# Altium schematic sheet Power.SchDoc
size A
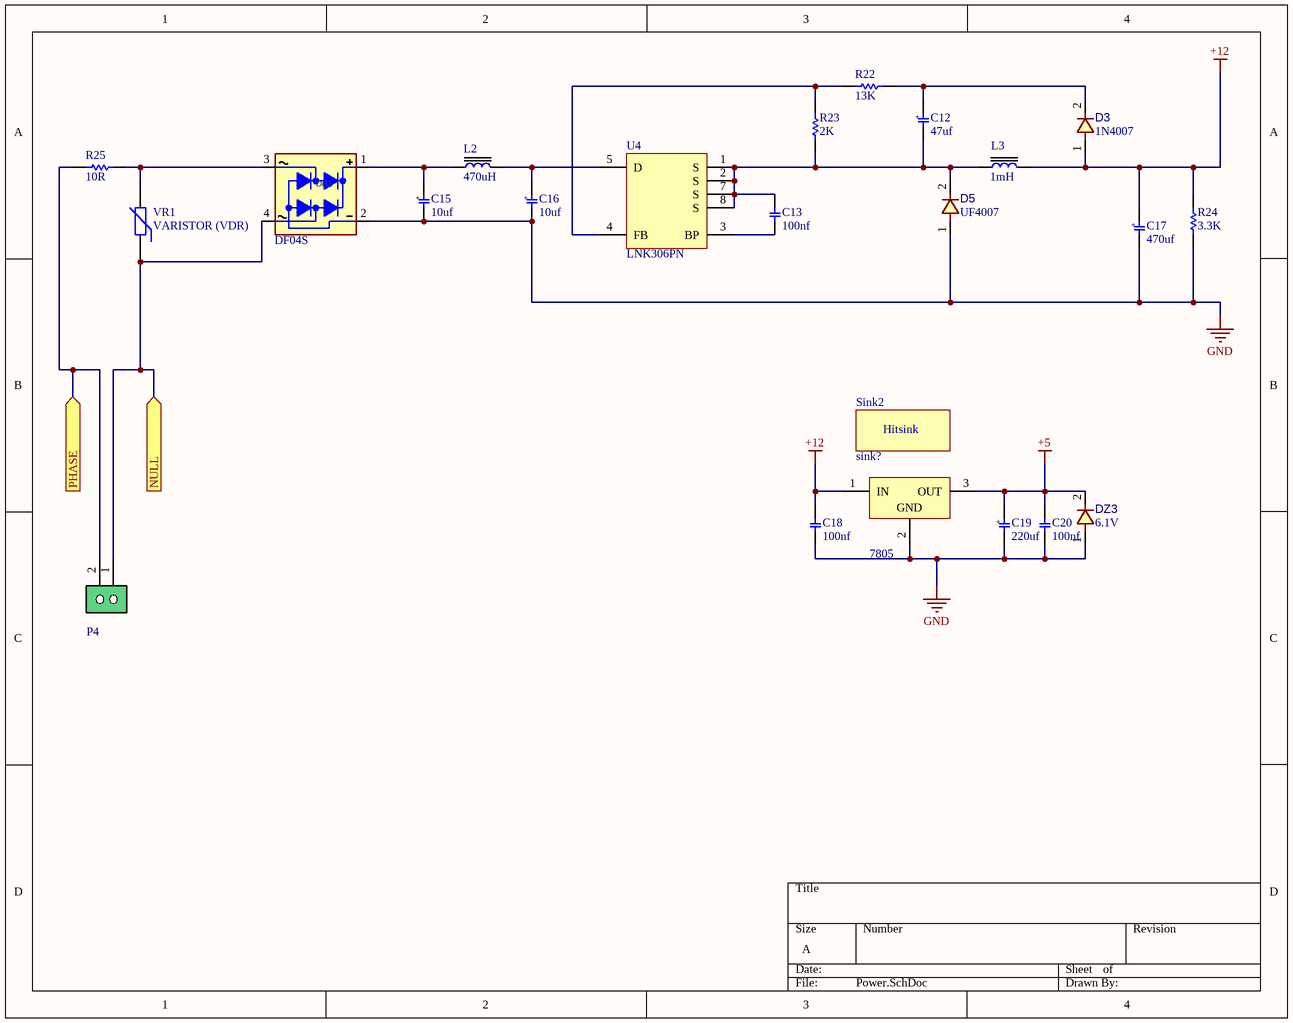
[diagram p0: Power.SchDoc]

## Parts
7805  7805CV  [TO220]  (value not drawn)
C12  value 47uf  [C_EL_6X11]  (hidden comment: Capacitor Electrical THD)
C13  value 100nf  [C1206]  (hidden comment: Capacitor C SMD 1206)
C15  value 10uf  [C_EL_10X20]  (hidden comment: Capacitor Electrical THD)
C16  value 10uf  [C_EL_10X20]  (hidden comment: Capacitor Electrical THD)
C17  value 470uf  [C_EL_10X20]  (hidden comment: Capacitor Electrical THD)
C18  value 100nf  [C1206]  (hidden comment: Capacitor C SMD 1206)
C19  value 220uf  [C_EL_5X7]  (hidden comment: Capacitor Electrical THD)
C20  value 100nf  [C1206]  (hidden comment: Capacitor C SMD 1206)
D3  value 1N4007  [D_SMA]  (hidden comment: 1N4007 SMD M7)
D5  value UF4007  [D_SMA]  (hidden comment: 1N4007 SMD M7)
DB1  value DF04S  [DBRG_DIPSMD]  (hidden comment: Diode Bridge SMD)
DZ3  value 6.1V  [D_SOD80]  (hidden comment: 1N4148 SMD)
L2  value 470uH  [LT_AX04]  (hidden comment: Inductor THD)
L3  value 1mH  [LT_C10]  (hidden comment: Inductor THD)
P4  Phoenix 2  [PRKR2A]  (value not drawn)
R22  value 13K  [Res-(1/4)]  (hidden comment: Resistor THD)
R23  value 2K  [Res-(1/4)]  (hidden comment: Resistor THD)
R24  value 3.3K  [SMD-1206-RES]  (hidden comment: Resistor SMD 1206)
R25  value 10R  [R2W_AX08]  (hidden comment: Resistor THD)
Sink2  sink?  [heatsink (4)]
U4  LNK306PN  [PI-DIP-8B]
VR1  VARISTOR (VDR)  [Varistor Short  Vertical]

## Ports
NULL (in), PHASE (in)

## Nets
+5: 7805.3(OUT) C19.1 C20.2 DZ3.2
+12: 7805.1(IN) C17.1 C18.2 D3.1 L3.2 R24.2
GND: 7805.2(GND) C15.2 C16.2 C17.2 C18.1 C19.2 C20.1 D5.1 DB1.2(DCOUT-) DZ3.1 R24.1
NULL: DB1.4(ACIN1) P4.1 VR1.1 ; port NULL
PHASE: P4.2 R25.1 ; port PHASE
NetC12_1: C12.1 D3.2 R22.2
NetC12_2: C12.2 C13.2 D5.2 L3.1 R23.1 U4.1(S) U4.2(S) U4.7(S) U4.8(S)
NetC13_1: C13.1 U4.3(BP)
NetC15_1: C15.1 DB1.1(DCOUT+) L2.1
NetC16_1: C16.1 L2.2 U4.5(D)
NetDB1_3: DB1.3(ACIN2) R25.2 VR1.2
NetR22_1: R22.1 R23.2 U4.4(FB)

## Notes on the sheet
- (in symbol Capacitor Electrical THD) +

## Library data of the parts
7805 = 7805: ComponentLink1Description: Website Smart World; ComponentLink1URL: https://www.smartw.ir/; ComponentLink2Description: Telegram; ComponentLink2URL: https://t.me/altium_smartw; ComponentLink3Description: Instagram; ComponentLink3URL: https://Instagram.com/smartgw.ir; DatasheetVersion: 2021
D3 D5 = 1N4007 SMD M7: DIODE, GENERAL PURPOSE, 1000V/1A; DatasheetVersion: 2021; ComponentLink1Description: Website Smart World; ComponentLink1URL: https://www.smartw.ir/; ComponentLink2Description: Telegram; ComponentLink2URL: https://t.me/altium_smartw; ComponentLink3Description: Instagram; ComponentLink3URL: https://Instagram.com/smartgw.ir
DB1 = Diode Bridge SMD: DIODE, BRIDGE,; DatasheetVersion: 2021; ComponentLink1Description: Website Smart World; ComponentLink1URL: https://www.smartw.ir/; ComponentLink2Description: Telegram; ComponentLink2URL: https://t.me/altium_smartw; ComponentLink3Description: Instagram; ComponentLink3URL: https://Instagram.com/smartgw.ir
DZ3 = 1N4148 SMD: DIODE, FAST SWTICHING, 0.3A, 0.5W; DatasheetVersion: 2021; ComponentLink1Description: Website Smart World; ComponentLink1URL: https://www.smartw.ir/; ComponentLink2Description: Telegram; ComponentLink2URL: https://t.me/altium_smartw; ComponentLink3Description: Instagram; ComponentLink3URL: https://Instagram.com/smartgw.ir
Sink2 = Hitsink
U4 = CMP-2000-06570-1: Lowest Component Count, Energy-Efficient Off-Line Switcher IC, 85 to 265 V Input, -40 to 150 degC, 7-Pin PDIP (P), RoHS, Tube; Manufacturer: Power Integrations; Input voltage: 85...265VAC; Function: Regulator; Output type: Adjustable; Topology: Flyback; Mounting Technology: ThroughHole; Manufacturer URL: https://www.power.com/; Package: DIP-8B(7-lead); Datasheet Version: Rev. J, 06/2013; Datasheet URL: http://www.mouser.com/ds/2/328/lnk302_304-306-179954.pdf; Package Description: 7-Pin Double In-line Package, Body 6.35 x 9.575 mm, Pitch 2.54 mm; Package Reference: DIP-8B
VR1 = VARISTOR (VDR): VARISTORS; ComponentLink1Description: Website Smart World; ComponentLink1URL: https://www.smartw.ir/; ComponentLink2Description: Telegram; ComponentLink2URL: https://t.me/altium_smartw; ComponentLink3Description: Instagram; ComponentLink3URL: https://Instagram.com/smartgw.ir; DatasheetVersion: 2021
C12 C15-C17 C19 = Capacitor Electrical THD: DatasheetVersion: 2021; ComponentLink1Description: Website Smart World; ComponentLink1URL: https://www.smartw.ir/; ComponentLink2Description: Telegram; ComponentLink2URL: https://t.me/altium_smartw; ComponentLink3Description: Instagram; ComponentLink3URL: https://Instagram.com/smartgw.ir
C13 C18 C20 = Capacitor C SMD 1206: DatasheetVersion: 2021; ComponentLink1Description: Website Smart World; ComponentLink1URL: https://www.smartw.ir/; ComponentLink2Description: Telegram; ComponentLink2URL: https://t.me/altium_smartw; ComponentLink3Description: Instagram; ComponentLink3URL: https://Instagram.com/smartgw.ir
L2 L3 = Inductor THD: DatasheetVersion: 2021; ComponentLink1Description: Website Smart World; ComponentLink1URL: https://www.smartw.ir/; ComponentLink2Description: Telegram; ComponentLink2URL: https://t.me/altium_smartw; ComponentLink3Description: Instagram; ComponentLink3URL: https://Instagram.com/smartgw.ir
P4 = Phoenix 2: ComponentLinkp-URL: https://www.smartw.ir/; DatasheetVersion: 2021; ComponentLink1Description: Website Smart World; ComponentLink1URL: https://www.smartw.ir/; ComponentLink2Description: Telegram; ComponentLink2URL: https://t.me/altium_smartw; ComponentLink3Description: Instagram; ComponentLink3URL: https://Instagram.com/smartgw.ir
R22 R23 R25 = Resistor THD: DatasheetVersion: 2021; ComponentLink1Description: Website Smart World; ComponentLink1URL: https://www.smartw.ir/; ComponentLink2Description: Telegram; ComponentLink2URL: https://t.me/altium_smartw; ComponentLink3Description: Instagram; ComponentLink3URL: https://Instagram.com/smartgw.ir
R24 = Resistor SMD 1206: DatasheetVersion: 2021; ComponentLink1Description: Website Smart World; ComponentLink1URL: https://www.smartw.ir/; ComponentLink2Description: Telegram; ComponentLink2URL: https://t.me/altium_smartw; ComponentLink3Description: Instagram; ComponentLink3URL: https://Instagram.com/smartgw.ir